# EAGLE design STorM32 Micro BGC v620-010 (EAGLE 7.5.0)
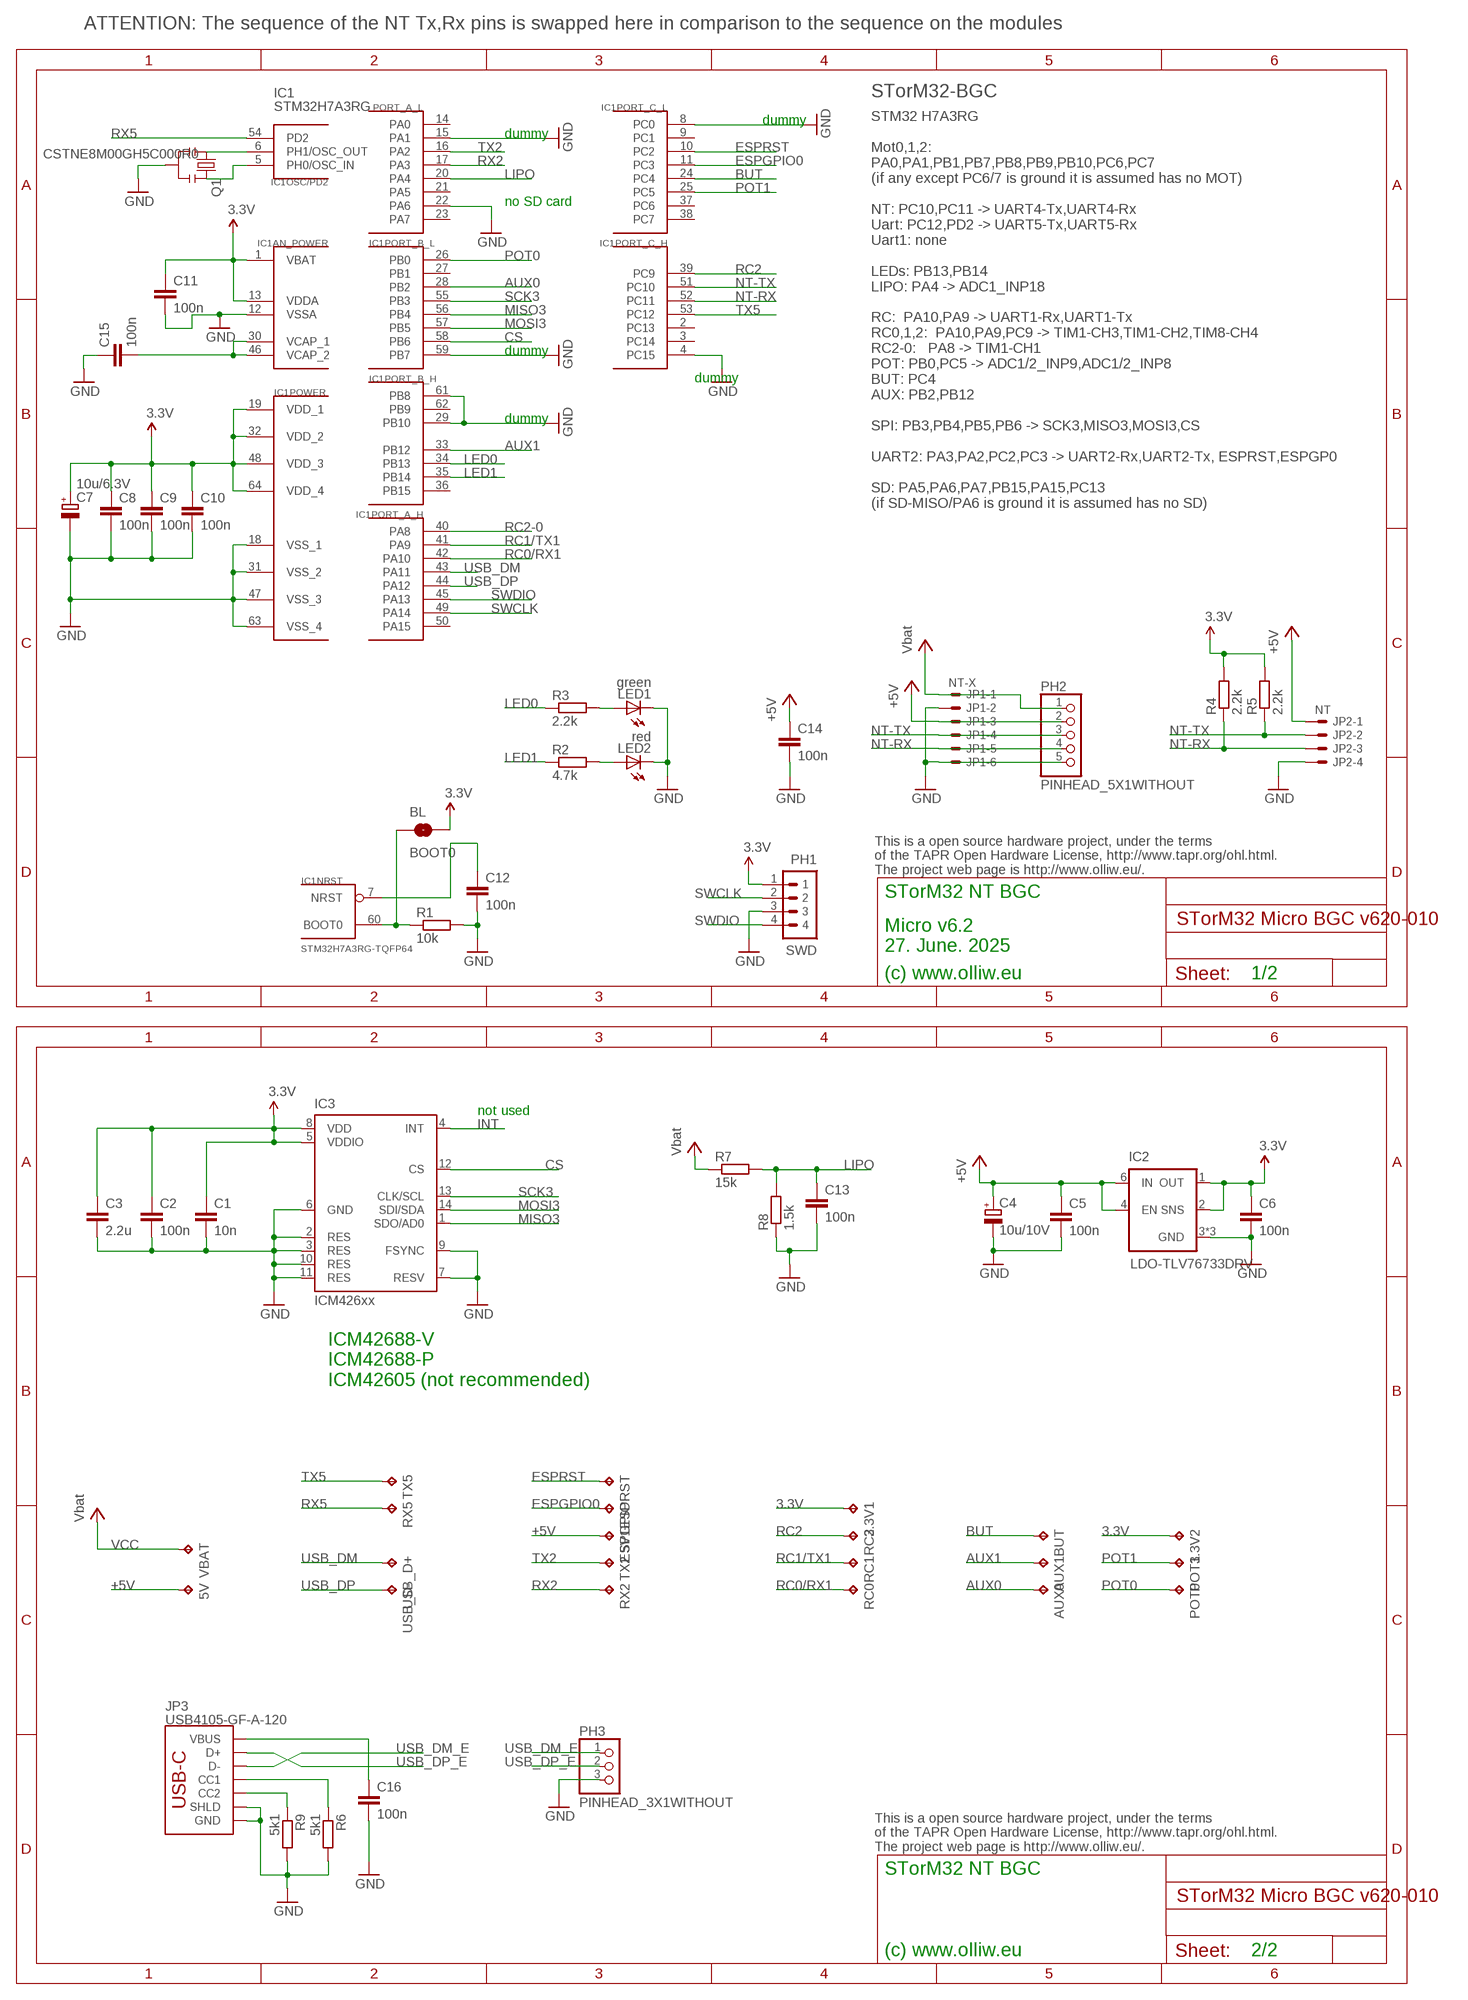
[diagram p0: schematic, sheet 1]

## Parts
3.3V1  TPB1,27  [B1,27]
3.3V2  TPB1,27  [B1,27]
5V  TPB1,27  [B1,27]
5V1  TPB1,27  [B1,27]
AUX0  TPB1,27  [B1,27]
AUX1  TPB1,27  [B1,27]
BL  BOOT0  SOLDERJUMPERNO  [SJ_2S-NO]
BUT  TPB1,27  [B1,27]
C1  10n  C-EUC0402  [C0402]
C2  100n  C-EUC0402  [C0402]
C3  2.2u  C-EUC0603  [C0603]
C4  10u/10V  CPOL-EUSMCA  [SMC_A]
C5  100n  C-EUC0603  [C0603]
C6  100n  C-EUC0402  [C0402]
C7  10u/6.3V  CPOL-EUSMCA  [SMC_A]
C8  100n  C-EUC0402  [C0402]
C9  100n  C-EUC0402  [C0402]
C10  100n  C-EUC0402  [C0402]
C11  100n  C-EUC0402  [C0402]
C12  100n  C-EUC0402  [C0402]
C13  100n  C-EUC0402  [C0402]
C14  100n  C-EUC0402  [C0402]
C15  100n  C-EUC0402  [C0402]
C16  100n  C-EUC0402  [C0402]
ESPGPIO  TPB1,27  [B1,27]
ESPRST  TPB1,27  [B1,27]
IC1  STM32H7A3RG-TQFP64  STM32H7A3-TQFP64  [TQFP64]
IC2  LDO-TLV76733DRV  LDO-TLV767  [WSON-6-2X2]
IC3  ICM426xx  ICM42605  [LGA14-2.5X3]
JP1  NT-X  SM06B-SRSS-TB  [SM06B-SRSS-TB]
JP2  NT  SM04B-SRSS-TB  [SM04B-SRSS-TB]
JP3  USB4105-GF-A-120  USB-C  [USB-C]
LED1  green  LEDCHIPLED_0603  [CHIPLED_0603]
LED2  red  LEDCHIPLED_0603  [CHIPLED_0603]
PH1  SWD  P4X1_1P27-OCT_BILEX  [4X1_1P27_OCT_BILEX]
PH2  PINHEAD_5X1WITHOUT  [PINHEAD_5X1_WO]
PH3  PINHEAD_3X1WITHOUT  [PINHEAD_3X1_WO]
POT0  TPB1,27  [B1,27]
POT1  TPB1,27  [B1,27]
Q1  CSTNE8M00GH5C000R0  RESONATORSMD  [RESONATOR-SMD]
R1  10k  R-EU_R0402  [R0402]
R2  4.7k  R-EU_R0402  [R0402]
R3  2.2k  R-EU_R0402  [R0402]
R4  2.2k  R-EU_R0402  [R0402]
R5  2.2k  R-EU_R0402  [R0402]
R6  5k1  R-EU_R0402  [R0402]
R7  15k  R-EU_R0402  [R0402]
R8  1.5k  R-EU_R0402  [R0402]
R9  5k1  R-EU_R0402  [R0402]
RC0  TPB1,27  [B1,27]
RC1  TPB1,27  [B1,27]
RC2  TPB1,27  [B1,27]
RX2  TPB1,27  [B1,27]
RX5  TPB1,27  [B1,27]
TX2  TPB1,27  [B1,27]
TX5  TPB1,27  [B1,27]
USB_D+  TPB1,27  [B1,27]
USB_D-  TPB1,27  [B1,27]
VBAT  TPB1,27  [B1,27]

## Nets
3.3V: 3.3V1.TP 3.3V2.TP BL.2 C1.1 C2.1 C3.1 C6.1 C7.+ C8.1 C9.1 C10.1 C11.1 IC1.1(AN_POWER:VBAT) IC1.13(AN_POWER:VDDA) IC1.19(POWER:VDD_1) IC1.32(POWER:VDD_2) IC1.48(POWER:VDD_3) IC1.64(POWER:VDD_4) IC2.1(OUT) IC2.2(SNS) IC3.5(VDDIO) IC3.8(VDD) PH1.1 R4.2 R5.2
+5V: 5V1.TP 5V.TP C4.+ C5.1 C14.1 IC2.4(EN) IC2.6(IN) JP1.3 JP2.1 PH2.2
AUX0: AUX0.TP IC1.28(PORT_B_L:PB2)
AUX1: AUX1.TP IC1.33(PORT_B_H:PB12)
BOOT0: BL.1 IC1.60(NRST:BOOT0) R1.1
BUT: BUT.TP IC1.24(PORT_C_L:PC4)
CS: IC1.58(PORT_B_L:PB6) IC3.12(CS)
ESPGPIO0: ESPGPIO.TP IC1.11(PORT_C_L:PC3)
ESPRST: ESPRST.TP IC1.10(PORT_C_L:PC2)
GND: C1.2 C2.2 C3.2 C4.- C5.2 C6.2 C7.- C8.2 C9.2 C10.2 C11.2 C12.2 C13.2 C14.2 C15.1 C16.2 IC1.4(PORT_C_H:PC15) IC1.8(PORT_C_L:PC0) IC1.12(AN_POWER:VSSA) IC1.15(PORT_A_L:PA1) IC1.18(POWER:VSS_1) IC1.22(PORT_A_L:PA6) IC1.29(PORT_B_H:PB10) IC1.31(POWER:VSS_2) IC1.47(POWER:VSS_3) IC1.59(PORT_B_L:PB7) IC1.61(PORT_B_H:PB8) IC1.63(POWER:VSS_4) IC2.3(GND) IC2.5(GND) IC2.7(GND) IC3.2(RES) IC3.3(RES) IC3.6(GND) IC3.7(RESV) IC3.9(FSYNC) IC3.10(RES) IC3.11(RES) JP1.2 JP1.6 JP2.4 JP3.GND JP3.GND2(GND) JP3.SHLD1(SHLD) JP3.SHLD2(SHLD) JP3.SHLD3(SHLD) JP3.SHLD4(SHLD) LED1.C LED2.C PH1.3 PH2.5 PH3.3 Q1.2 R1.2 R6.2 R8.1 R9.2
INT: IC3.4(INT)
LED0: IC1.34(PORT_B_H:PB13) R3.1
LED1: IC1.35(PORT_B_H:PB14) R2.1
LIPO: C13.1 IC1.20(PORT_A_L:PA4) R7.2 R8.2
MISO3: IC1.56(PORT_B_L:PB4) IC3.1(SDO/AD0)
MOSI3: IC1.57(PORT_B_L:PB5) IC3.14(SDI/SDA)
N$3: JP3.B5(CC2) R9.1
N$6: C16.1 JP3.VBUS1(VBUS) JP3.VBUS2(VBUS)
N$8: LED1.A R3.2
N$9: LED2.A R2.2
N$10: JP3.A5(CC1) R6.1
N$11: IC1.5(OSC/PD2:PH0/OSC_IN) Q1.3
N$12: IC1.6(OSC/PD2:PH1/OSC_OUT) Q1.1
NRST: C12.1 IC1.7(NRST:NRST)
NT-RX: IC1.52(PORT_C_H:PC11) JP1.5 JP2.3 PH2.4 R4.1
NT-TX: IC1.51(PORT_C_H:PC10) JP1.4 JP2.2 PH2.3 R5.1
POT0: IC1.26(PORT_B_L:PB0) POT0.TP
POT1: IC1.25(PORT_C_L:PC5) POT1.TP
RC0/RX1: IC1.42(PORT_A_H:PA10) RC0.TP
RC1/TX1: IC1.41(PORT_A_H:PA9) RC1.TP
RC2: IC1.39(PORT_C_H:PC9) RC2.TP
RC2-0: IC1.40(PORT_A_H:PA8)
RX2: IC1.17(PORT_A_L:PA3) RX2.TP
RX5: IC1.54(OSC/PD2:PD2) RX5.TP
SCK3: IC1.55(PORT_B_L:PB3) IC3.13(CLK/SCL)
SWCLK: IC1.49(PORT_A_H:PA14) PH1.2
SWDIO: IC1.45(PORT_A_H:PA13) PH1.4
TX2: IC1.16(PORT_A_L:PA2) TX2.TP
TX5: IC1.53(PORT_C_H:PC12) TX5.TP
USB_DM: IC1.43(PORT_A_H:PA11) USB_D+.TP
USB_DM_E: JP3.A7(D-) JP3.B7(D-) PH3.1
USB_DP: IC1.44(PORT_A_H:PA12) USB_D-.TP
USB_DP_E: JP3.A6(D+) JP3.B6(D+) PH3.2
VCAP_1: C15.2 IC1.30(AN_POWER:VCAP_1) IC1.46(AN_POWER:VCAP_2)
VCC: JP1.1 PH2.1 R7.1 VBAT.TP ; supply symbol labelled Vbat
Unconnected: IC1.2(PORT_C_H:PC13) IC1.3(PORT_C_H:PC14) IC1.9(PORT_C_L:PC1) IC1.14(PORT_A_L:PA0) IC1.21(PORT_A_L:PA5) IC1.23(PORT_A_L:PA7) IC1.27(PORT_B_L:PB1) IC1.36(PORT_B_H:PB15) IC1.37(PORT_C_L:PC6) IC1.38(PORT_C_L:PC7) IC1.50(PORT_A_H:PA15) IC1.62(PORT_B_H:PB9)

## Notes on the sheet
- ATTENTION: The sequence of the NT Tx,Rx pins is swapped here in comparison to the sequence on the modules
- IC1 | STorM32-BGC
- STM32H7A3RG
- STM32 H7A3RG
  
  Mot0,1,2:
  PA0,PA1,PB1,PB7,PB8,PB9,PB10,PC6,PC7
  (if any except PC6/7 is ground it is assumed has no MOT)
  
  NT: PC10,PC11 -> UART4-Tx,UART4-Rx
  Uart: PC12,PD2 -> UART5-Tx,UART5-Rx
  Uart1: none
  
  LEDs: PB13,PB14
  LIPO: PA4 -> ADC1_INP18
  
  RC:  PA10,PA9 -> UART1-Rx,UART1-Tx
  RC0,1,2:  PA10,PA9,PC9 -> TIM1-CH3,TIM1-CH2,TIM8-CH4
  RC2-0:   PA8 -> TIM1-CH1
  POT: PB0,PC5 -> ADC1/2_INP9,ADC1/2_INP8
  BUT: PC4
  AUX: PB2,PB12
  
  SPI: PB3,PB4,PB5,PB6 -> SCK3,MISO3,MOSI3,CS
  
  UART2: PA3,PA2,PC2,PC3 -> UART2-Rx,UART2-Tx, ESPRST,ESPGP0
  
  SD: PA5,PA6,PA7,PB15,PA15,PC13
  (if SD-MISO/PA6 is ground it is assumed has no SD)
- dummy
- dummy
- no SD card
- dummy
- dummy
- dummy
- This is a open source hardware project, under the terms
  of the TAPR Open Hardware License, http://www.tapr.org/ohl.html.
  The project web page is http://www.olliw.eu/.
- STorM32 NT BGC
- Micro v6.2
  27. June. 2025
- (c) www.olliw.eu | 1/2
- not used
- ICM42688-V
  ICM42688-P
  ICM42605 (not recommended)
- This is a open source hardware project, under the terms
  of the TAPR Open Hardware License, http://www.tapr.org/ohl.html.
  The project web page is http://www.olliw.eu/.
- STorM32 NT BGC
- (c) www.olliw.eu | 2/2

## Library data of the parts
3.3V1 3.3V2 5V 5V1 AUX0 AUX1 BUT ESPGPIO ESPRST POT0 POT1 RC0 RC1 RC2 RX2 RX5 TX2 TX5 USB_D+ USB_D- VBAT = testpad:TP: Test pad
BL = # SparkFun2:SOLDERJUMPER: Solder Jumper Standard SMD solder jumper. Used to automate production. Two varients : Normally Open and Normally Closed are the same, but have different paste layers. NC will have a large amount of paste and should jumper during reflow.
C1-C3 C5 C6 C8-C16 = rcl:C-EU: CAPACITOR, European symbol
C4 C7 = rcl:CPOL-EU: POLARIZED CAPACITOR, European symbol
IC1 = # stm32:STM32H7A3
IC2 = # stdlib:LDO-TLV767
IC3 = # stdlib:ICM42605
JP1 = con-jst2:?M06B-SRSS-TB: Disconnectable Crimp style connector, 1.0mm pitch 6 contacts
JP2 = con-jst2:?M04B-SRSS-TB: Disconnectable Crimp style connector, 1.0mm pitch 4 contacts
JP3 = # stdlib:USB
LED1 LED2 = led:LED: LED OSRAM: - CHIPLED LG R971, LG N971, LY N971, LG Q971, LY Q971, LO R971, LY R971 LH N974, LH R974 LS Q976, LO Q976, LY Q976 LO Q996 - Hyper CHIPLED LW Q18S LB Q993, LB Q99A, LB R99A - SideLED LS A670, LO A670, LY A670, LG A670, LP A670 LB A673, LV A673, LT A673, LW A673 LH A674 LY A675 LS A676, LA A676, LO A676, LY A676, LW A676 LS A679, LY A679, LG A679 - Hyper Micro SIDELED® LS Y876, LA Y876, LO Y876, LY Y876 LT Y87S - SmartLED LW L88C, LW L88S LB L89C, LB L89S, LG L890 LS L89K, LO L89K, LY L89K LS L896, LA L896, LO L896, LY L896 - TOPLED LS T670, LO T670, LY T670, LG T670, LP T670 LSG T670, LSP T670, LSY T670, LOP T670, LYG T670 LG T671, LOG T671, LSG T671 LB T673, LV T673, LT T673, LW T673 LH T674 LS T676, LA T676, LO T676, LY T676, LB T676, LH T676, LSB T676, LW T676 LB T67C, LV T67C, LT T67C, LS T67K, LO T67K, LY T67K, LW E67C LS E67B, LA E67B, LO E67B, LY E67B, LB E67C, LV E67C, LT E67C LW T67C LS T679, LY T679, LG T679 LS T770, LO T770, LY T770, LG T770, LP T770 LB T773, LV T773, LT T773, LW T773 LH T774 LS E675, LA E675, LY E675, LS T675 LS T776, LA T776, LO T776, LY T776, LB T776 LHGB T686 LT T68C, LB T68C - Hyper Mini TOPLED® LB M676 - Mini TOPLED Santana® LG M470 LS M47K, LO M47K, LY M47K Source: http://www.osram.convergy.de LUXEON: - LUMILED® LXK2-PW12-R00, LXK2-PW12-S00, LXK2-PW14-U00, LXK2-PW14-V00 LXK2-PM12-R00, LXK2-PM12-S00, LXK2-PM14-U00 LXK2-PE12-Q00, LXK2-PE12-R00, LXK2-PE12-S00, LXK2-PE14-T00, LXK2-PE14-U00 LXK2-PB12-K00, LXK2-PB12-L00, LXK2-PB12-M00, LXK2-PB14-N00, LXK2-PB14-P00, LXK2-PB14-Q00 LXK2-PR12-L00, LXK2-PR12-M00, LXK2-PR14-Q00, LXK2-PR14-R00 LXK2-PD12-Q00, LXK2-PD12-R00, LXK2-PD12-S00 LXK2-PH12-R00, LXK2-PH12-S00 LXK2-PL12-P00, LXK2-PL12-Q00, LXK2-PL12-R00 Source: www.luxeon.com KINGBRIGHT: KA-3528ASYC Source: www.kingbright.com
PH1 = # stdlib:P4X1_1P27
PH2 = # stdlib:PINHEAD_5X1
PH3 = # stdlib:PINHEAD_3X1
Q1 = # SparkFun2:RESONATOR: Resonator Small SMD resonator. This is the itty bitty 10/20MHz resonators with built in caps. CSTCE10M0G55 and CSTCE20M0V53. Footprint has been reviewed closely but hasn't been tested yet.
R1-R9 = rcl:R-EU_: RESISTOR, European symbol

## Board
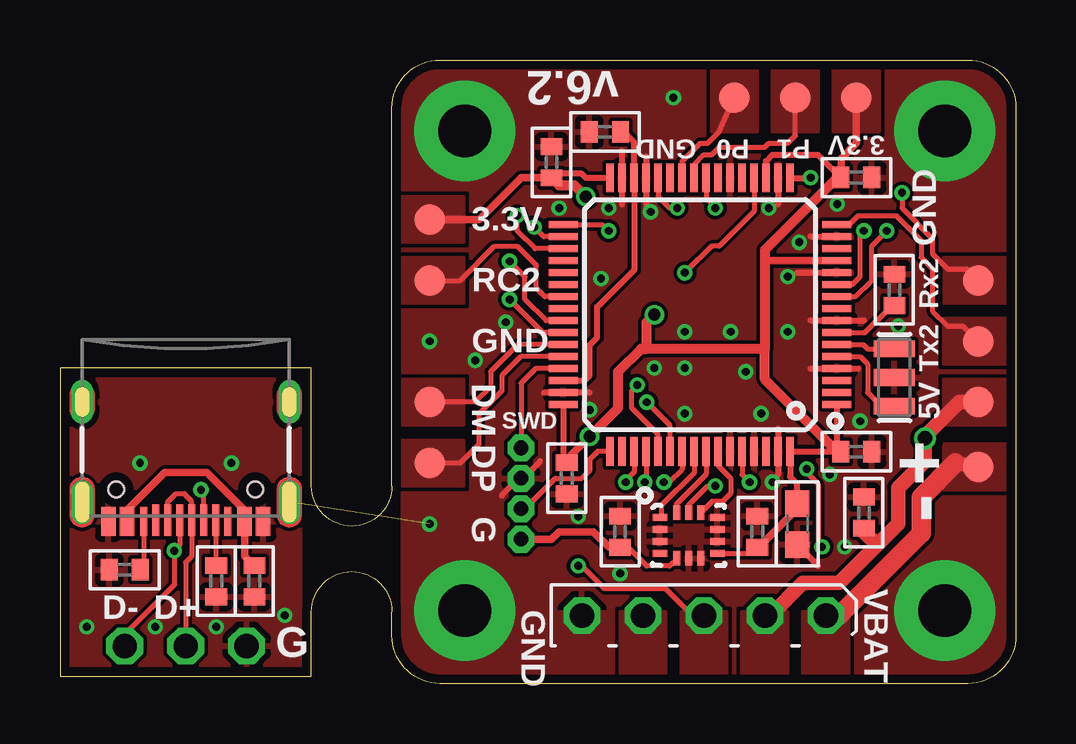
[diagram p1: board, top side]
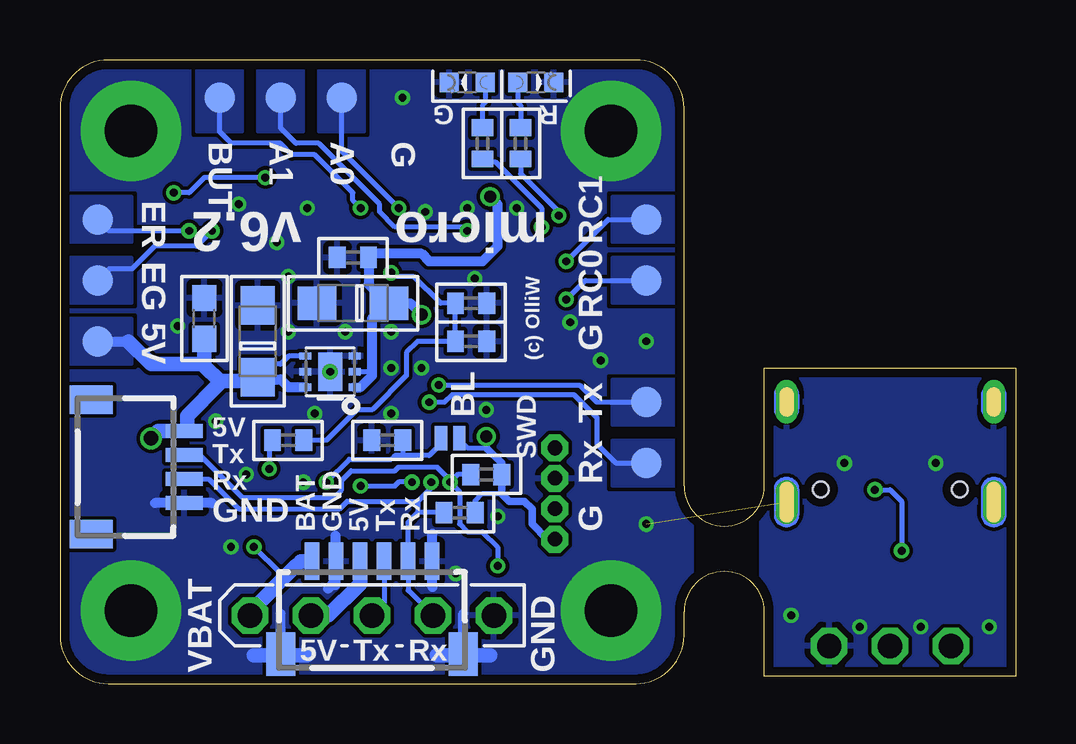
[diagram p2: board, bottom side, seen from below]

Size 39.83 x 26 mm. Coordinates in mm from the lower left corner, seen from the top.
Outline: 37.83,0 15.83,0 arc-90 13.83,2 13.83,3 arc180 10.48,3 10.48,0.3 0,0.3 0,13.16 10.48,13.16 10.48,8.24 arc180 13.83,8.24 13.83,24 arc-90 15.83,26 37.83,26 arc-90 39.83,24 39.83,2 arc-90 37.83,0
Copper layers (1*16): Top 0.035mm / dielectric 1.5mm / Bottom 0.035mm
Design rules "ShenZhen2U_2layer_EagleRules *": minimum track width 6mil, minimum drill 12mil, track to track 6mil, track to pad 6mil, pad to pad 6mil, via to via 6mil, smd to smd 0mil, copper to edge 15mil, drill to drill 10mil, minimum pad ring 10mil, minimum via ring 6mil, stop-mask expansion 2mil, vias tented up to drill 25mil, thermal gap 10mil

### Footprints (pad centres in the part's own frame; a part is rotated, then mirrored left to right if it is on the bottom)
B1,27 = smd 1.27 x 1.27: TP 0,0
SJ_2S-NO = smd 0.508 x 1.016: 1 -0.381,0; 2 0.381,0
C0402 = smd 0.7 x 0.9: 1 -0.65,0; 2 0.65,0
C0603 = smd 1.1 x 1: 1 -0.85,0; 2 0.85,0
SMC_A = smd 1.6 x 1.4: + -1.5,0; - 1.5,0
TQFP64 = smd 1.2 x 0.3: 1 -5.7,3.75; 2 -5.7,3.25; 3 -5.7,2.75; 4 -5.7,2.25; 5 -5.7,1.75; 6 -5.7,1.25; 7 -5.7,0.75; 8 -5.7,0.25; 9 -5.7,-0.25; 10 -5.7,-0.75; 11 -5.7,-1.25; 12 -5.7,-1.75; 13 -5.7,-2.25; 14 -5.7,-2.75; 15 -5.7,-3.25; 16 -5.7,-3.75; 33 5.7,-3.75; 34 5.7,-3.25; 35 5.7,-2.75; 36 5.7,-2.25; 37 5.7,-1.75; 38 5.7,-1.25; 39 5.7,-0.75; 40 5.7,-0.25; 41 5.7,0.25; 42 5.7,0.75; 43 5.7,1.25; 44 5.7,1.75; 45 5.7,2.25; 46 5.7,2.75; 47 5.7,3.25; 48 5.7,3.75 | smd 0.3 x 1.2: 17 -3.75,-5.7; 18 -3.25,-5.7; 19 -2.75,-5.7; 20 -2.25,-5.7; 21 -1.75,-5.7; 22 -1.25,-5.7; 23 -0.75,-5.7; 24 -0.25,-5.7; 25 0.25,-5.7; 26 0.75,-5.7; 27 1.25,-5.7; 28 1.75,-5.7; 29 2.25,-5.7; 30 2.75,-5.7; 31 3.25,-5.7; 32 3.75,-5.7; 49 3.75,5.7; 50 3.25,5.7; 51 2.75,5.7; 52 2.25,5.7; 53 1.75,5.7; 54 1.25,5.7; 55 0.75,5.7; 56 0.25,5.7; 57 -0.25,5.7; 58 -0.75,5.7; 59 -1.25,5.7; 60 -1.75,5.7; 61 -2.25,5.7; 62 -2.75,5.7; 63 -3.25,5.7; 64 -3.75,5.7
WSON-6-2X2 = smd 0.5 x 0.3: 1 -1.025,0.65; 2 -1.025,0; 3 -1.025,-0.65; 4 1.025,-0.65; 5 1.025,0; 6 1.025,0.65 | smd 1 x 1.6: 7 0,0
LGA14-2.5X3 = smd 0.6 x 0.3: 1 -1.2,0.75; 2 -1.2,0.25; 3 -1.2,-0.25; 4 -1.2,-0.75; 8 1.2,-0.75; 9 1.2,-0.25; 10 1.2,0.25; 11 1.2,0.75 | smd 0.3 x 0.6: 5 -0.5,-0.95; 6 0,-0.95; 7 0.5,-0.95; 12 0.5,0.95; 13 0,0.95; 14 -0.5,0.95
SM06B-SRSS-TB = smd 0.6 x 1.55: 1 -2.5,2.975; 2 -1.5,2.975; 3 -0.5,2.975; 4 0.5,2.975; 5 1.5,2.975; 6 2.5,2.975 | smd 1.2 x 1.8: FIT@1 -3.8,-0.9; FIT@2 3.8,-0.9
SM04B-SRSS-TB = smd 0.6 x 1.55: 1 -1.5,2.975; 2 -0.5,2.975; 3 0.5,2.975; 4 1.5,2.975 | smd 1.2 x 1.8: FIT@1 -2.8,-0.9; FIT@2 2.8,-0.9
USB-C = smd 0.3 x 1.3: A5 -1.25,3.65; A6 -0.25,3.65; A7 0.25,3.65; A8 1.25,3.65; B6 0.75,3.65; B7 -0.75,3.65 | smd 0.3 x 1.2: B5 1.75,3.7; B8 -1.75,3.7 | smd 0.6 x 1.2: GND -3.225,3.7; GND2 3.225,3.7; VBUS1 -2.45,3.7; VBUS2 2.45,3.7 | drill 0.4 pad 0.6 long: SHLD1 -4.318,2.895; SHLD2 4.318,2.895; SHLD3 -4.318,-1.285; SHLD4 4.318,-1.285 | hole 0.65: -2.89,2.365; 2.89,2.365
CHIPLED_0603 = smd 0.8 x 0.8: A 0,-0.75; C 0,0.75
4X1_1P27_OCT_BILEX = drill 0.61 pad 1.118 octagon: 1 0,0; 2 0,-1.27; 3 0,-2.54; 4 0,-3.81
PINHEAD_5X1_WO = drill 1.016 octagon: 1 0,0; 2 0,-2.54; 3 0,-5.08; 4 0,-7.62; 5 0,-10.16
PINHEAD_3X1_WO = drill 1.016 octagon: 1 0,0; 2 0,-2.54; 3 0,-5.08
RESONATOR-SMD = smd 0.7 x 1.7: 1 -1.2,0; 2 0,0; 3 1.2,0
R0402 = smd 0.7 x 0.9: 1 -0.65,0; 2 0.65,0

### Placement (x,y rotation side)
3.3V1  15.4,19.35 0 top
3.3V2  33.18,24.43 0 top
5V  38.26,11.73 0 top
5V1  38.26,14.27 0 bottom
AUX0  28.1,24.43 0 bottom
AUX1  30.64,24.43 0 bottom
BL  23.57,10.22 0 bottom
BUT  33.18,24.43 0 bottom
C1  29.05,6.33 90 top
C2  23.34,6.33 90 top
C3  30.72,6.65 270 top
C4  31.59,14.27 90 bottom
C5  33.81,15.22 90 bottom
C6  27.62,17.76 180 bottom
C7  27.62,15.86 180 bottom
C8  33.18,9.67 0 top
C9  20.48,21.73 90 top
C10  21.11,8.55 270 top
C11  33.18,21.1 0 top
C12  34.77,16.41 90 top
C13  22.7,14.27 0 bottom
C14  33.5,7.13 90 top
C15  22.7,23 0 top
C16  8.1,4.27 270 top
ESPGPIO  38.26,16.81 0 bottom
ESPRST  38.26,19.35 0 bottom
IC1  26.67,15.38 180 top
IC2  28.58,13 180 bottom
IC3  26.19,6.17 0 top
JP1  26.83,2.13 0 bottom
JP2  37.62,9.03 270 bottom
JP3  5.24,10.46 180 top
LED1  22.86,25.06 90 bottom
LED2  20,25.06 270 bottom
PH1  19.21,6.02 180 top
PH2  31.91,2.84 270 top
PH3  2.7,1.57 90 top
POT0  28.1,24.43 0 top
POT1  30.64,24.43 0 top
Q1  34.77,12.76 270 top
R1  26.19,10.14 180 bottom
R2  20.64,22.52 90 bottom
R3  22.23,22.52 90 bottom
R4  23.18,7.13 0 bottom
R5  22.07,8.71 0 bottom
R6  6.51,4.27 270 top
R7  30.32,10.14 0 bottom
R8  22.7,15.86 180 bottom
R9  2.7,4.75 180 top
RC0  15.4,16.81 0 bottom
RC1  15.4,19.35 0 bottom
RC2  15.4,16.81 0 top
RX2  38.26,16.81 0 top
RX5  15.4,9.19 0 bottom
TX2  38.26,14.27 0 top
TX5  15.4,11.73 0 bottom
USB_D+  15.4,11.73 0 top
USB_D-  15.4,9.19 0 top
VBAT  38.26,9.03 0 top

### Tracks (layer width: path | path; a pad name or v marks a point on that pad's centre or on a via)
3.3V  (via drill 0.5)
  Top 0.203: 32.54,21.11 C11.1 | IC3.5 25.53,5.04 25.4,4.9 24.45,4.9 23.65,5.7 23.4,5.52 C2.1 23.34,5.54 | IC3.8 28.62,5.42 28.89,5.7 29.07,5.7
  Top 0.254: IC1.1 32.37,9.82 C8.1 32.67,9.68 32.37,9.68 IC1.64 30.42,8.62 30.72,8.32 C3.1 30.42,7.8 | IC1.48 20.97,9.35 C10.1 | IC1.19 29.42,21.78 29.69,22.05 31.58,22.05 C11.1 | 29.07,5.7 C1.1 | IC1.32 21.92,21.08 21.75,21.26 20.65,21.26 C9.1
  Top 0.305: C11.1 32.38,21.1 32.54,21.11 32.54,21.89 33.18,22.52 3.3V2.TP | C10.1 21.11,9.35 v22.07,10.3 | 3.3V1.TP 17.46,19.35 19.21,21.1 20.32,21.1 20.46,21.24 C9.1 | 29.37,17.76 29.55,17.63 IC1.13 | PH1.1 20.48,6.02 20.8,6.33 22.22,6.33 22.86,5.7 23.32,5.7 C2.1 | C1.1 29.19,5.76 30.48,7.05 30.66,7.29 C3.1
  Top 0.406: 32.38,21.1 29.37,18.08 29.37,17.76 29.37,13.95 | C8.1 32.37,9.68 29.37,12.68 29.37,13.95 | v22.07,10.3 23.26,11.49 23.26,13 24.21,13.95 24.45,13.95 | 29.37,13.95 24.45,13.95 | 24.45,13.95 24.45,15.06 v24.76,15.38 | 20.48,21.1 C9.1 20.49,21.08 20.8,20.78 21.43,20.78 v21.91,20.3
  Bottom 0.203: R4.2 22.53,7.62 22.22,7.92 21.43,7.92 21.42,7.9 | BL.2 23.03,10 22.86,9.82 22.07,9.82 | IC2.2 26.83,13 26.83,13.16
  Bottom 0.305: PH1.1 19.53,6.02 20.16,6.65 20.16,7.29 20.48,7.6 21.11,7.6 21.42,7.9 R5.2 21.43,8.73 21.43,9.19 22.07,9.82 v22.07,10.3
  Bottom 0.406: 24.6,15.38 24.61,15.38 v24.76,15.38 25.24,15.86 C7.+ | v21.91,20.3 21.59,19.98 21.59,18.24 22.22,17.6 24.45,17.6 24.76,17.92 26.81,17.92 C6.1 | 26.67,15.77 26.67,15.7 26.67,15.38 26.83,15.22 26.83,13.16 26.83,12.84 27.32,12.35 IC2.1 | 26.67,15.47 C7.+ | C6.1 26.97,16.64 26.67,16.33 26.67,15.77 | 26.67,15.77 C7.+ | 26.99,17.92 C6.1
  pour Top (isolate 0.305, no thermals): 13.97,20.3 16.83,20.3 16.83,18.4 13.97,18.4
  pour Top (isolate 0.305, no thermals): 32.23,25.86 34.13,25.86 34.13,23 32.23,23
+5V  (via drill 0.6)
  Top 0.203: C14.1 33.5,6.33
  Top 0.61: 5V.TP 37.46,11.73 36.04,10.3 v36.04,10.22 36.04,9.27 34.92,8.16 34.92,6.65 34.05,5.78 | PH2.2 29.61,2.84 30.96,4.19 32.46,4.19 34.05,5.78 | 33.5,6.33 34.05,5.78
  Bottom 0.203: 31.59,12.68 C4.+ 31.04,13.32 30.64,13.32 30.31,13.65 IC2.4
  Bottom 0.305: 31.68,12.84 C4.+
  Bottom 0.406: 5V1.TP 36.99,14.27 | 33.92,13.32 C5.1 | 31.59,12.68 30.64,12.68 30.31,12.35 IC2.6
  Bottom 0.61: JP1.3 27.33,4.17 28.65,2.84 PH2.2 | v36.04,10.22 35.73,10.53 JP2.1 34.54,10.53 34.54,11.17 33.18,12.52 33.18,12.61 | C5.1 33.81,13.25 33.18,12.61 | 36.99,14.27 36.04,13.32 33.92,13.32 | 33.18,12.61 31.75,12.61 C4.+
  pour Top (isolate 0.305, no thermals): 36.83,12.68 39.69,12.68 39.69,10.78 36.83,10.78
  pour Bottom (isolate 0.305, no thermals): 36.83,15.22 39.69,15.22 39.69,13.32 36.83,13.32
  pour Top (isolate 0.305, no thermals): 28.42,0.14 28.42,3 30.32,3 30.32,0.14
AUX0  (via drill 0.33)
  Top 0.203: IC1.28 24.92,20.31 25.4,19.83 v25.72,19.83
  Bottom 0.203: AUX0.TP 28.1,22.21 v25.72,19.83
  pour Bottom (isolate 0.305, no thermals): 27.15,25.86 29.05,25.86 29.05,23 27.15,23
AUX1  (via drill 0.33)
  Top 0.203: IC1.33 22.6,19.13 v22.86,18.87
  Bottom 0.203: v22.86,18.87 23.02,19.03 25.88,19.03 26.51,19.67 26.51,19.98 29.05,22.52 30,22.52 30.64,23.16 AUX1.TP
  pour Bottom (isolate 0.305, no thermals): 29.69,25.86 31.59,25.86 31.59,23 29.69,23
BOOT0  (via drill 0.33)
  Top 0.203: IC1.60 28.42,8.71 v28.73,8.4
  Bottom 0.203: v28.73,8.4 27.78,9.35 26.03,9.35 25.88,9.51 25.56,9.51 | 25.56,10.13 R1.1 25.54,9.52 25.56,9.51 | BL.1 23.96,10 24.45,9.51 25.56,9.51
BUT  (via drill 0.33)
  Top 0.203: IC1.24 26.92,20.21 v27.3,19.83
  Bottom 0.203: v27.3,19.83 27.62,20.14 27.62,20.46 29.21,22.05 30.16,22.05 30.64,22.52 32.7,22.52 33.18,23 BUT.TP
  pour Bottom (isolate 0.305, no thermals): 32.23,25.86 34.13,25.86 34.13,23 32.23,23
CS
  Top 0.203: IC3.12 27.17,7.6 27.62,7.6 27.94,7.92 27.94,8.55 27.42,9.07 IC1.58
ESPGPIO0  (via drill 0.33)
  Top 0.203: IC1.11 33,16.63 33.34,16.97 33.34,18.71 v33.5,18.87
  Bottom 0.203: v33.5,18.87 34.13,18.24 35.88,18.24 36.83,17.29 37.78,17.29 ESPGPIO.TP
  pour Bottom (isolate 0.305, no thermals): 39.69,17.76 36.83,17.76 36.83,15.86 39.69,15.86
ESPRST  (via drill 0.33)
  Top 0.203: v34.45,18.87 33.81,18.24 33.81,16.81 33.13,16.13 IC1.10
  Bottom 0.203: v34.45,18.87 37.78,18.87 ESPRST.TP
  pour Bottom (isolate 0.305, no thermals): 39.69,20.3 36.83,20.3 36.83,18.4 39.69,18.4
GND  (via drill 0.33, 2.2 pad 4.2)  (1 unrouted)
  Top 0.254: 23.42,22.21 23.42,19.98 | 24.42,21.97 24.42,19.75 | 29.92,21.41 29.92,19.98 | 30.72,17.13 32.78,17.13 | 22.07,12.13 20.16,12.13 | 29.92,10.62 29.92,8.71 | 30.88,5.62 31.59,4.9 | 18.41,7.84 19.21,8.63 | 19.21,8.48 20,9.27 | 31.27,18.64 32.86,18.64 | 31.27,15.14 33.5,15.14 | 31.27,13.13 33.26,13.13
  Bottom 0.406: 33.5,7.52 35.88,7.52 | 24.32,4.03 24.32,6.25 | 30.64,0.7 30.64,2.92 | 28.34,4.11 28.34,4.29 | 28.34,4.29 28.34,6.17 | 28.67,3.96 28.34,4.29 | 23.02,0.7 23.02,2.92
  Bottom 0.61: 31.75,1.17 29.53,1.17 | 24.13,1.17 21.91,1.17
  other vias: 16.87,3.04 36.87,3.04 16.87,23.04 36.87,23.04 29.21,11.25 25.56,24.43 15.4,14.27 15.4,6.65 29.69,8.4 17.3,13.48 26.04,13.16 30.32,14.67 30.32,16.97 24.61,19.67 32.7,5.7 20.8,19.83 23.34,4.59 27.94,14.67 26.04,14.67 22.54,16.89 26.04,11.25 21.59,6.97 22.86,19.83 30.8,18.4 32.38,19.98 29.53,19.83 18.57,15.06 34.93,14.9 32.07,8.71 33.34,10.94 28.58,13 6.51,2.36 3.97,2.36 9.37,2.84 1.11,2.36 3.33,9.19 7.14,9.19 24.77,13.16 22.07,11.41
  pour Top (isolate 0.152, rank 6): 14.29,-0.97 14.29,26.97 40.8,26.97 40.8,-0.97
  pour Bottom (isolate 0.152, rank 6): 13.49,-0.34 13.49,26.34 40.16,26.34 40.16,-0.34
  pour Top (isolate 0.152, rank 6): 10,-0.18 -0.48,-0.18 -0.48,13.63 10,13.63
  pour Bottom (isolate 0.152, rank 6): 10.64,0.14 -0.16,0.14 -0.16,13.32 10.64,13.32
  pour Top (isolate 0.305, no thermals): 20.8,0.14 20.8,3 22.7,3 22.7,0.14
LED0  (via drill 0.33)
  Top 0.203: IC1.34 20.17,18.63 v19.76,19.03
  Bottom 0.203: v19.76,19.03 19.76,19.83 21.67,21.73 21.91,21.73 22.07,21.89 R3.1
LED1  (via drill 0.33)
  Top 0.203: v19.05,19.51 19.05,18.87 19.79,18.13 IC1.35
  Bottom 0.203: R2.1 20.64,21.26 19.05,19.67 v19.05,19.51
LIPO  (via drill 0.33)
  Top 0.203: IC1.20 28.92,19.7 27.46,18.24 27.15,18.24 v26.03,17.13
  Bottom 0.203: R7.2 28.73,10.14 27.46,11.41 26.83,11.41 25.4,12.84 25.4,13.79 24.92,14.27 C13.1 R8.2 23.97,15.86 25.08,16.97 25.88,16.97 v26.03,17.13
MISO3
  Top 0.203: IC3.1 25.04,6.92 25.08,6.97 25.08,7.44 26.42,8.78 IC1.56
MOSI3
  Top 0.203: IC3.14 25.69,7.5 26.92,8.73 IC1.57
N$3
  Top 0.203: JP3.B5 3.49,4.88 R9.1
N$6
  Top 0.305: JP3.VBUS2 2.79,7.22 4.37,8.79 6.11,8.79 7.69,7.22 JP3.VBUS1 7.69,5.31 8.1,4.9 C16.1
N$8
  Bottom 0.203: LED1.A 22.11,24.23 22.22,24.11 R3.2
N$9
  Bottom 0.203: LED2.A 20.75,24.23 20.64,24.11 R2.2
N$10
  Top 0.203: JP3.A5 6.49,5.08 6.51,5.06 R6.1
N$11
  Top 0.203: Q1.3 35.15,11.65 34.13,11.65 33.65,12.13 33.65,13.32 33.34,13.63 IC1.5
N$12
  Top 0.203: Q1.1 34.84,13.95 33.65,13.95 33.48,14.13 IC1.6
NRST
  Top 0.203: C12.1 34.94,15.7 34.61,15.7 33.54,14.63 IC1.7
NT-RX  (via drill 0.33)
  Top 0.203: IC1.52 24.42,8.45 v24.37,8.4
  Bottom 0.203: PH2.4 25.33,3.88 JP1.5 25.33,6.72 24.92,7.13 | JP2.3 33.63,8.53 32.38,7.29 28.18,7.29 27.86,7.6 24.92,7.6 | 24.92,7.6 24.37,8.16 v24.37,8.4 | 24.92,7.6 24.92,7.13 | R4.1 24.92,7.13
  pour Top (isolate 0.305, no thermals): 23.34,0.14 23.34,3 25.24,3 25.24,0.14
NT-TX  (via drill 0.33)
  Top 0.203: PH2.3 26.35,2.84 25.24,3.95 22.7,3.95 21.75,4.9 v21.59,4.9 | IC1.51 23.92,8.82 23.57,8.48 v23.57,8.4
  Bottom 0.203: JP1.4 26.33,3.34 PH2.3 | JP2.2 34,9.53 32.23,7.76 28.42,7.76 28.1,8.08 28.1,8.48 27.7,8.87 25.88,8.87 25.72,9.03 24.13,9.03 23.57,8.48 v23.57,8.4 | v23.57,8.4 23.18,8 23.18,6.65 22.86,6.33 22.22,6.33 21.59,5.7 v21.59,4.9 | R5.1 23.26,8.71 v23.57,8.4
  pour Top (isolate 0.305, no thermals): 25.88,0.14 25.88,3 27.78,3 27.78,0.14
POT0
  Top 0.203: POT0.TP 27.46,23 26.99,22.52 26.67,22.52 25.92,21.77 IC1.26
  pour Top (isolate 0.305, no thermals): 27.15,25.86 27.15,23 29.05,23 29.05,25.86
POT1
  Top 0.203: POT1.TP 30.64,22.84 30.32,22.52 29.53,22.52 29.37,22.37 27.46,22.37 27.15,22.05 26.83,22.05 26.42,21.64 IC1.25
  pour Top (isolate 0.305, no thermals): 29.69,25.86 31.59,25.86 31.59,23 29.69,23
RC0/RX1  (via drill 0.33)
  Top 0.203: IC1.42 20.12,14.63 v18.73,16.02
  Bottom 0.203: RC0.TP 17.94,16.81 v18.73,16.02
  pour Bottom (isolate 0.305, no thermals): 13.97,17.76 16.83,17.76 16.83,15.86 13.97,15.86
RC1/TX1  (via drill 0.33)
  Top 0.203: v18.73,17.6 19.37,16.97 19.37,16.02 20.25,15.13 IC1.41
  Bottom 0.203: v18.73,17.6 16.99,19.35 RC1.TP
  pour Bottom (isolate 0.305, no thermals): 13.97,20.3 16.83,20.3 16.83,18.4 13.97,18.4
RC2
  Top 0.203: RC2.TP 16.67,16.81 18.1,18.24 19.05,18.24 19.84,17.45 19.84,16.49 20.2,16.13 IC1.39
  pour Top (isolate 0.305, no thermals): 13.97,17.76 16.83,17.76 16.83,15.86 13.97,15.86
RX2  (via drill 0.33)
  Top 0.203: 31.13,21.08 v31.27,21.1 | v35.08,20.46 35.08,19.83 36.35,18.56 36.35,17.92 36.99,17.29 37.78,17.29 RX2.TP
  Top 0.254: IC1.17 31.13,21.08 31.26,21.08 v31.27,21.1
  Bottom 0.203: v31.27,21.1 33.81,21.1 34.45,20.46 v35.08,20.46
  pour Top (isolate 0.305, no thermals): 36.83,17.76 39.69,17.76 39.69,15.86 36.83,15.86
RX5  (via drill 0.33)
  Top 0.203: IC1.54 25.42,10.76 v24.45,11.73
  Bottom 0.203: v24.45,11.73 23.81,11.73 23.49,12.05 18.41,12.05 17.46,11.1 17.46,9.98 16.67,9.19 RX5.TP
  pour Bottom (isolate 0.305, no thermals): 13.97,10.14 16.83,10.14 16.83,8.24 13.97,8.24
SCK3  (via drill 0.33)
  Top 0.203: v25.16,8.4 25.4,8.4 25.92,8.92 IC1.55 | IC3.13 26.19,7.44 26.99,8.24 v27.3,8.24
  Bottom 0.203: v27.3,8.24 25.88,8.24 25.72,8.4 v25.16,8.4
SWCLK
  Top 0.203: PH1.2 19.37,7.29 20.64,8.55 21.75,8.55 22.07,8.87 22.07,9.35 22.4,9.68 IC1.49
SWDIO
  Top 0.203: PH1.4 19.21,12.52 19.82,13.13 IC1.45
TX2
  Top 0.203: TX2.TP 37.62,14.9 36.99,14.9 36.35,15.54 36.35,17.29 35.88,17.76 35.88,18.48 34.85,19.51 33.26,19.51 32.88,19.13 IC1.16
  pour Top (isolate 0.305, no thermals): 36.83,13.32 39.69,13.32 39.69,15.22 36.83,15.22
TX5  (via drill 0.33)
  Top 0.203: v24.05,12.44 23.81,12.21 23.81,11.49 24.92,10.38 IC1.53
  Bottom 0.203: v24.05,12.44 18.18,12.44 17.46,11.73 TX5.TP
  pour Bottom (isolate 0.305, no thermals): 13.97,12.68 16.83,12.68 16.83,10.78 13.97,10.78
USB_DM
  Top 0.203: USB_D+.TP 17.3,11.73 17.94,12.37 17.94,13 19.07,14.13 IC1.43
  pour Top (isolate 0.305, no thermals): 16.83,12.68 13.97,12.68 13.89,10.78 16.83,10.78
USB_DM_E  (via drill 0.33)
  Top 0.203: JP3.B7 5.99,7.96 v5.87,8.08 | JP3.A7 4.99,5.77 v4.76,5.54 4.76,4.11 2.7,2.05 PH3.1
  Bottom 0.203: v5.87,8.08 5.24,8.08 4.76,7.6 v4.76,5.54
USB_DP
  Top 0.203: USB_D-.TP 16.67,9.19 17.46,9.98 17.46,11.25 18.41,12.21 18.41,12.84 19.2,13.63 IC1.44
  pour Top (isolate 0.305, no thermals): 13.97,10.14 16.83,10.14 16.83,8.24 13.97,8.24
USB_DP_E
  Top 0.203: PH3.2 5.24,5.06 5.49,5.31 JP3.A6 5.49,7.59 5.16,7.92 4.84,7.92 4.49,7.57 JP3.B6
VCAP_1
  Top 0.254: IC1.46 21.86,12.63 22.07,12.84 22.07,14.11 22.38,14.43 22.38,15.7 23.92,17.23 IC1.30 23.92,22.58 23.51,22.99 C15.2
VCC  (via drill 0.33)
  Top 0.203: v31.11,8.95 31.11,8.79 31.59,8.32 31.59,5.86 v31.75,5.7
  Top 0.61: VBAT.TP 37.31,9.19
  Top 0.813: 37.31,9.19 35.88,7.76 35.88,6.25 32.46,2.84 PH2.1
  Bottom 0.203: R7.1 31.11,10.3 v31.11,8.95 | 30,4.9 30,5.06 30.64,4.43 30.64,4.59 v31.75,5.7
  Bottom 0.61: JP1.1 29.81,5.1 30,4.9 31.91,3 PH2.1
  pour Top (isolate 0.305, no thermals): 36.83,9.98 39.69,9.98 39.69,8.08 36.83,8.08
  pour Top (isolate 0.305, no thermals): 30.96,0.14 30.96,3 32.86,3 32.86,0.14

### Text on the board
tNames: v6.2 | GND | P0 | P1 | 3.3V | 3.3V | GND | RC2 | Rx2 | GND | DM | Tx2 | SWD | 5V | DP | + | - | G | VBAT | D- | D+ | GND | G
bNames: R | G | G | A0 | A1 | BUT | micro | v6.2 | ER | RC1 | EG | RC0 | 5V | G | (c) OlliW | SWD | Tx | BL | 5V | Rx | Tx | Rx | G | Rx | Tx | 5V | GND | BAT | GND | GND | Rx | Tx | 5V | VBAT